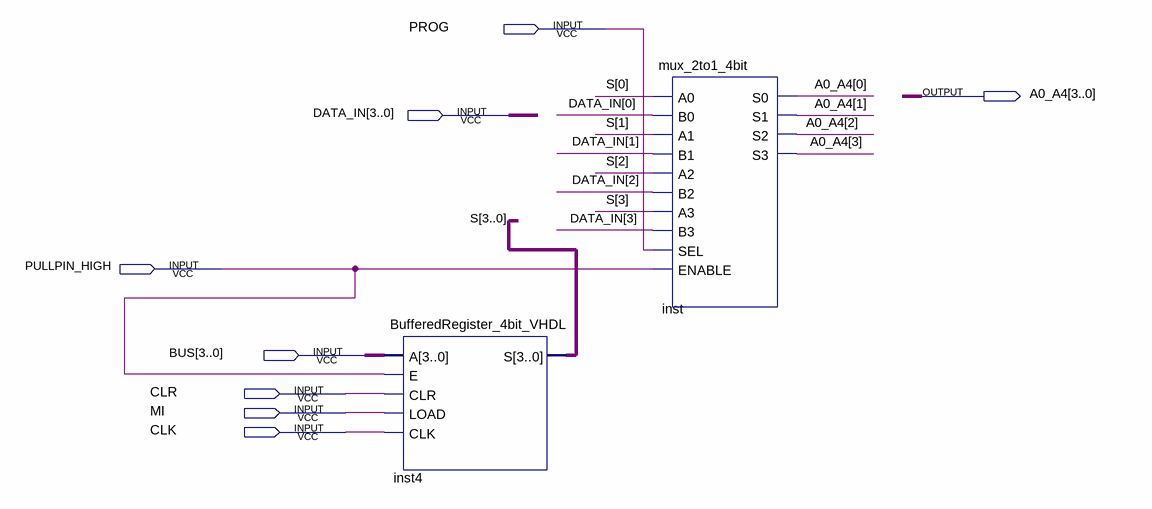
[diagram p0: schematic sheet]
// Quartus schematic MemAddrReg_4bit.bdf as structural Verilog: 2 symbols, 8 pins
module MemAddrReg_4bit (
  input  PROG,
  input  [3:0] DATA_IN,
  input  PULLPIN_HIGH,
  input  [3:0] BUS,
  input  CLR,
  input  MI,
  input  CLK,
  output [3:0] A0_A4
);

  wire [3:0] S;

  BufferedRegister_4bit_VHDL inst4 (.A(BUS), .E(PULLPIN_HIGH), .CLR(CLR), .LOAD(MI), .CLK(CLK), .S(S));
  mux_2to1_4bit inst (
    .A0(S[0]), .B0(DATA_IN[0]), .A1(S[1]), .B1(DATA_IN[1]), .A2(S[2]), .B2(DATA_IN[2]), .A3(S[3]),
    .B3(DATA_IN[3]), .SEL(PROG), .ENABLE(PULLPIN_HIGH), .S0(A0_A4[0]), .S1(A0_A4[1]), .S2(A0_A4[2]),
    .S3(A0_A4[3]));
endmodule
